# Altium project PCB_Project_Wearable_Master.PrjPcb
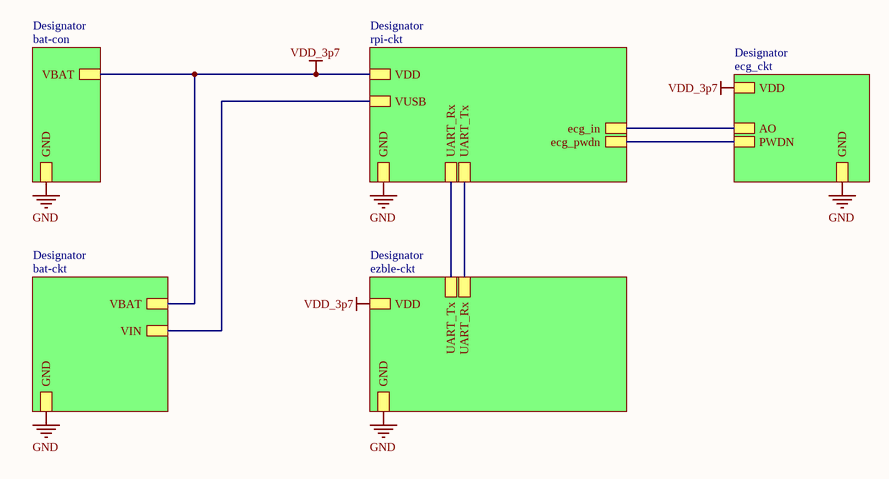
[diagram p0: main.SchDoc]
5 sheets, 46 parts. Net scope: hierarchical (ports join the sheet entries above them; power ports are global).
Sheets:
  main.SchDoc
    Designator = bat-ckt.SchDoc
    Designator = rpi-ckt.SchDoc
    Designator = ezble-ckt.SchDoc
    Designator = ecg_ckt.SchDoc

## Sheet main.SchDoc
size A4; SheetNumber: 1; SheetTotal: 4

### Sub-sheets
Designator = bat-ckt: VBAT, GND, VIN
Designator = bat-con (file not in this document): VBAT, GND
Designator = rpi-ckt: VUSB, VDD, GND, UART_Tx, UART_Rx, ecg_in, ecg_pwdn
Designator = ezble-ckt: UART_Tx, UART_Rx, VDD, GND
Designator = ecg_ckt: VDD, AO, PWDN, GND

### Nets
GND: sheet Designator/GND, sheet Designator/VIN, sheet Designator/GND, sheet Designator/VUSB, sheet Designator/GND, sheet Designator/GND, sheet Designator/GND  [project net QSPI_SS]
VDD_3p7: sheet Designator/VBAT, sheet Designator/VBAT, sheet Designator/VDD, sheet Designator/VDD, sheet Designator/VDD  [project net IOVDD1]
NetRP?_37: sheet Designator/ecg_in, sheet Designator/AO
(unnamed): sheet Designator/UART_Tx, sheet Designator/UART_Rx
(unnamed): sheet Designator/UART_Rx, sheet Designator/UART_Tx
(unnamed): sheet Designator/ecg_pwdn, sheet Designator/PWDN

## Sheet bat-ckt.SchDoc
size A4; SheetNumber: 3; SheetTotal: 5
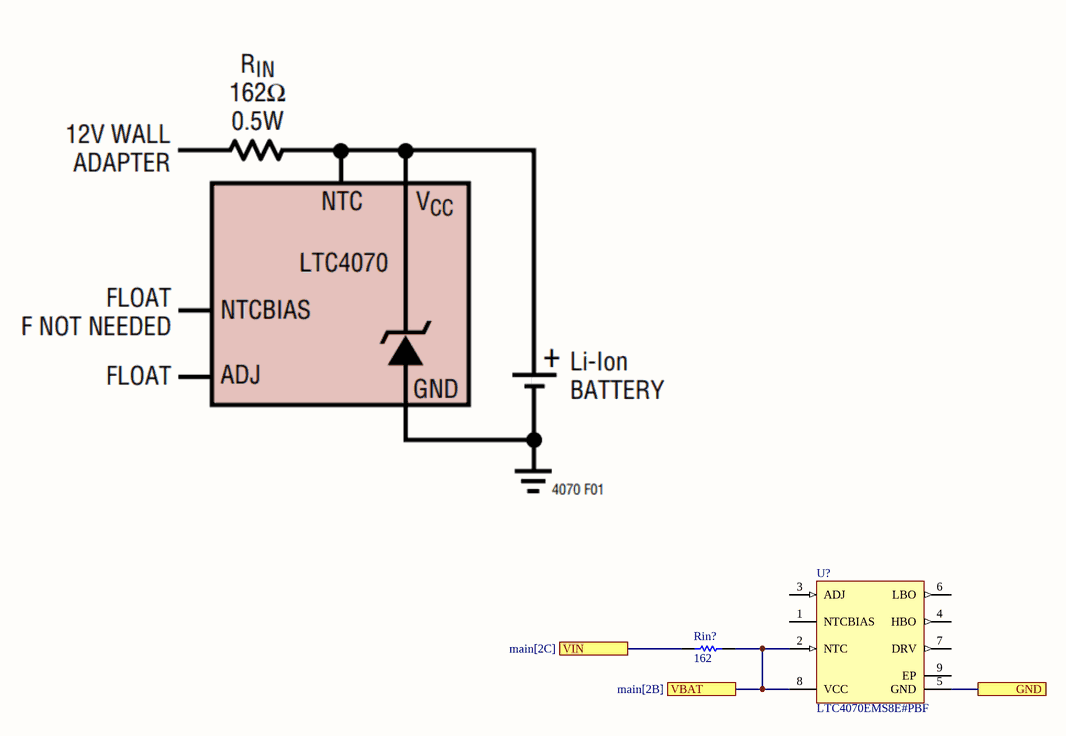
[diagram p1: bat-ckt.SchDoc]

### Parts
(Parts that share a designator on the sheet are numbered #1, #2 ... from top to bottom, then left to right.)
Rin?  value 162  (hidden comment: Resistor)
U?#1  LTC4070EMS8E#PBF  [LT-MS8E-8-2060X1830TP_M]

### Ports
GND, VBAT (see main[2B]), VIN (see main[2C])

### Nets
IOVDD1: Rin?.2 U?#1.2(NTC) U?#1.8(VCC) ; port VBAT
QSPI_SS: Rin?.1 U?#1.5(GND) ; port GND, port VIN

Not connected (* = marked no-connect by the designer): U?#1 1(NTCBIAS) 3(ADJ) 4(HBO) 6(LBO) 7(DRV) 9(EP)

### Library data of the parts
Rin? = Resistor: TC1: 0; SimulationGenericComponent: True; TC2: 0
U?#1 = CMP-0473-00111-1: Li-Ion / Polymer Shunt Battery Charger System, 8-pin SOP (MS8E-8), -40 to 125 degC, Pb-Free; Manufacturer: Linear Technology; Number of Outputs: 1; Topology: Shunt Battery Charger; ComponentLink3URL: http://cds.linear.com/docs/en/datasheet/4070fc.pdf; PackageReference: MS8E-8; ComponentLink1Description: Manufacturer URL; ComponentLink2URL: http://cds.linear.com/docs/en/datasheet/4070fc.pdf; PackageVersion: Rev. E; ComponentLink3Description: Package Specification; ComponentLink1URL: http://www.linear.com/; PackageDescription: 8-Pin Plastic MSOP, Exposed Die Pad, Body 3 x 3 mm, Pitch 0.65 mm; RoHS: TRUE; Mounting Technology: Surface Mount; DatasheetVersion: Rev. E; PartNumber: LTC4070EMS8E#PBF; ComponentLink2Description: Datasheet

## Sheet rpi-ckt.SchDoc
size A4; SheetNumber: 5; SheetTotal: 5
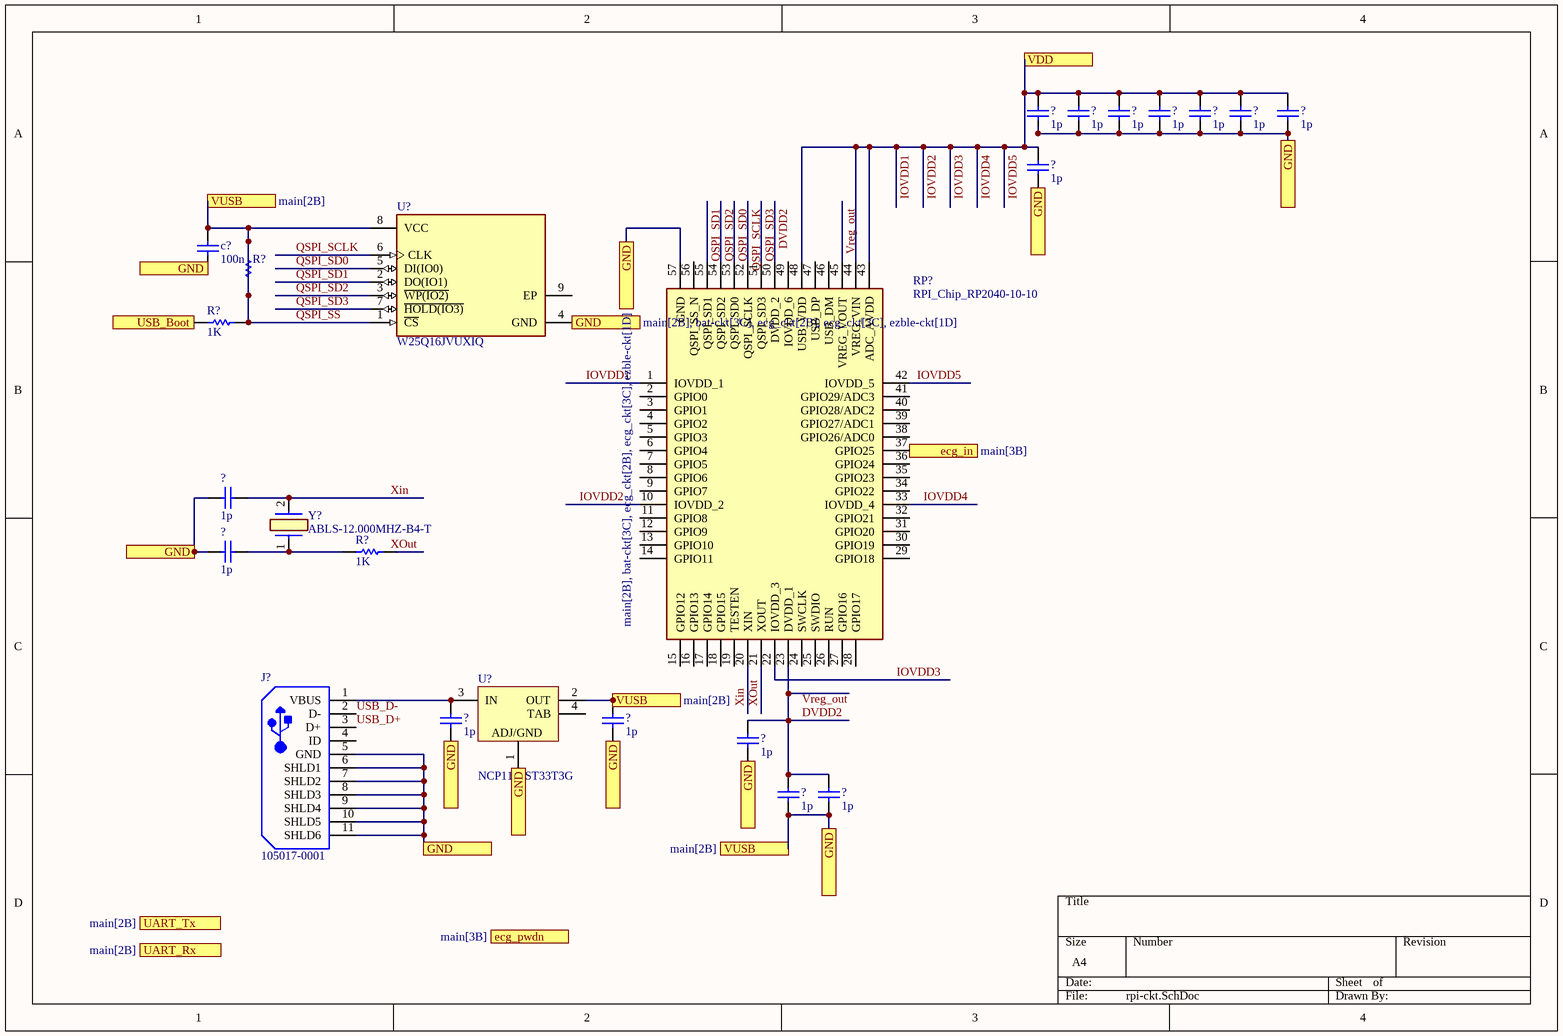
[diagram p2: rpi-ckt.SchDoc]

### Parts
(Parts that share a designator on the sheet are numbered #1, #2 ... from top to bottom, then left to right.)
?#1  value 1p  (hidden comment: Capacitor)
?#2  value 1p  (hidden comment: Capacitor)
?#3  value 1p  (hidden comment: Capacitor)
?#4  value 1p  (hidden comment: Capacitor)
?#5  value 1p  (hidden comment: Capacitor)
?#6  value 1p  (hidden comment: Capacitor)
?#7  value 1p  (hidden comment: Capacitor)
?#8  value 1p  (hidden comment: Capacitor)
?#9  value 1p  (hidden comment: Capacitor)
?#10  value 1p  (hidden comment: Capacitor)
?#11  value 1p  (hidden comment: Capacitor)
?#12  value 1p  (hidden comment: Capacitor)
?#13  value 1p  (hidden comment: Capacitor)
?#14  value 1p  (hidden comment: Capacitor)
?#15  value 1p  (hidden comment: Capacitor)
c?#1  value 100n  (hidden comment: Capacitor)
J?#1  105017-0001  [USB-MICRO-B_V]
R?#1  Resistor  (value not drawn)
R?#2  value 1K  (hidden comment: Resistor)
R?#3  value 1K  (hidden comment: Resistor)
RP?  RPI_Chip_RP2040-10-10  [QFN40P700X700X90-57N-D]
U?#2  W25Q16JVUXIQ  [FP-UX-MFG]
U?#3  NCP1117ST33T3G  [ONSC-SOT-223-4-318H-01_A_V]
Y?  ABLS-12.000MHZ-B4-T  [ABLS]

### Ports
ecg_in (see main[3B]), ecg_pwdn (see main[3B]), GND, GND (see main[2B], bat-ckt[3C], ecg_ckt[2B], ecg_ckt[3C], ezble-ckt[1D]), UART_Rx (see main[2B]), UART_Tx (see main[2B]), USB_Boot, VDD, VUSB (see main[2B])

### Nets
IOVDD1: ?#1.2 ?#2.2 ?#3.2 ?#4.2 ?#5.2 ?#6.2 ?#7.2 ?#8.2 RP?.1(IOVDD_1) RP?.10(IOVDD_2) RP?.22(IOVDD_3) RP?.33(IOVDD_4) RP?.42(IOVDD_5) RP?.43(ADC_AVDD) RP?.44(VREG_VIN) RP?.48(USB_VDD) ; port VDD  [also labelled IOVDD2, IOVDD3, IOVDD4, IOVDD5]
QSPI_SS: ?#1.1 ?#2.1 ?#3.1 ?#4.1 ?#5.1 ?#6.1 ?#7.1 ?#8.1 ?#9.1 ?#10.1 ?#11.1 ?#12.1 ?#12.2 ?#13.1 ?#14.2 ?#15.1 c?#1.1 c?#1.2 J?#1.5(GND) J?#1.6(SHLD1) J?#1.7(SHLD2) J?#1.8(SHLD3) J?#1.9(SHLD4) J?#1.10(SHLD5) J?#1.11(SHLD6) R?#1.1 R?#1.2 R?#2.2 RP?.57(GND) U?#2.1(~{CS}) U?#2.4(GND) U?#2.8(VCC) U?#3.1(ADJ/GND) U?#3.2(OUT) ; port VUSB, port GND
DVDD2: ?#13.2 ?#14.1 ?#15.2 RP?.23(DVDD_1) RP?.50(DVDD_2)
QSPI_SCLK: RP?.52(QSPI_SCLK) U?#2.6(CLK)
QSPI_SD0: RP?.53(QSPI_SD0) U?#2.5(DI(IO0))
QSPI_SD1: RP?.55(QSPI_SD1) U?#2.2(DO(IO1))
QSPI_SD2: RP?.54(QSPI_SD2) U?#2.3(~{WP(IO2)})
QSPI_SD3: RP?.51(QSPI_SD3) U?#2.7(~{HOLD(IO3)})
USB_D+: J?#1.3(D+)
USB_D-: J?#1.2(D-)
Vreg_out: RP?.45(VREG_VOUT)
Xin: ?#9.2 RP?.20(XIN) Y?.2
XOut: RP?.21(XOUT)
Net?#10_2: ?#10.2 R?#3.1 Y?.1
Net?#11_2: ?#11.2 J?#1.1(VBUS) U?#3.3(IN)
NetR?#2_1: R?#2.1 ; port USB_Boot
NetRP?_37: RP?.37(GPIO25) ; port ecg_in

Not connected (* = marked no-connect by the designer): J?#1 4(ID); R?#3 2; RP? 2(GPIO0) 3(GPIO1) 4(GPIO2) 5(GPIO3) 6(GPIO4) 7(GPIO5) 8(GPIO6) 9(GPIO7) 11(GPIO8) 12(GPIO9) 13(GPIO10) 14(GPIO11) 15(GPIO12) 16(GPIO13) 17(GPIO14) 18(GPIO15) 19(TESTEN) 24(SWCLK) 25(SWDIO) 26(RUN) 27(GPIO16) 28(GPIO17) 29(GPIO18) 30(GPIO19) 31(GPIO20) 32(GPIO21) 34(GPIO22) 35(GPIO23) 36(GPIO24) 38(GPIO26/ADC0) 39(GPIO27/ADC1) 40(GPIO28/ADC2) 41(GPIO29/ADC3) 46(USB_DM) 47(USB_DP) 49(IOVDD_6) 56(QSPI_SS_N); U?#2 9(EP); U?#3 4(TAB)

### Notes on the sheet
- Labels drawn without touching a wire or pin: Vreg_out, XOut

### Library data of the parts
?#1-?#15 c?#1 = Capacitor: SimulationGenericComponent: True
J?#1 = CMP-2000-05827-1: Micro-USB B Receptacle, Right Angle, Bottom Mount, Surface Mount, with Solder Tabs, -30 to 85 degC, 5-Pin USB, RoHS, Tape and Reel; Manufacturer: Molex; Featured Product: Micro-USBConnectorsUSBConnectors; Other Names: WM1399DKR; Package Version: Rev. F, 12/2012; Number of Contacts: 5; Connector Type: USB-microB; Catalog Drawings: 1050170001; 3D Model: 105017-0001.stp; Mating Products: WM17145-ND-CABLEMICROUSBBTOSTDA1.0MWM17147-ND-CABLEMICROUSBBTOSTDA2.0MWM17146-ND-CABLEMICROUSBBTOSTDA1.5M; PCN Assembly/Origin: ResinSupplier21/Oct/2015; Voltage - Max: 30V; Online Catalog: Molex-MicroUSB; Manufacturer URL: http://www.molex.com/; Package Description: 5-Leads USB, Micro B, Body 7.5 x 5 mm, Pitch 0.65 mm; Datasheet URL: http://www.molex.com/elqNow/elqRedir.htm?ref=http://www.molex.com/webdocs/datasheets/pdf/en-us/1050170001_IO_CONNECTORS.pdf; Ingress Protection: -; Datasheet Version: 03/2016; Mounting Type: BoardCutout,SurfaceMount,RightAngle; Circuits: 5; Standard Package: 1; Package Reference: MICRO-B; Package URL: http://www.molex.com/pdm_docs/sd/1050170001_sd.pdf; Category: Connectors,Interconnects; Series: -; RoHS Information: 1050170001CertofCompliance; Features: Shielded,SolderRetention; Family: USB,DVI,HDMIConnectors; Specifications: -; Gender: Receptacle; Packaging: Digi-Reel®; Mounting Technology: SurfaceMount
R?#1-R?#3 = Resistor: TC1: 0; SimulationGenericComponent: True; TC2: 0
RP? = RPI_Chip_RP2040-10-10: Integrated Circuit; Manufacturer_Name: RASPBERRY-PI; Manufacturer_Part_Number: RPI Chip RP2040-10-10; Datasheet Link: https://datasheets.raspberrypi.com/rp2040/rp2040-datasheet.pdf; Height: 0.9mm; Mouser Part Number: 358-RP2040CHIP-10-10; Mouser Price/Stock: https://www.mouser.co.uk/ProductDetail/Raspberry-Pi/RPI-Chip-RP2040-10-10?qs=QNEnbhJQKva2vG4DZ5VuhA%3D%3D
U?#2 = CMP-78876-000011-1: IC FLASH 16MBIT SPI/QUAD 8USON; RoHS Compliant: Yes
U?#3 = CMP-1679-00010-1: Low-Dropout Positive Fixed Voltage Regulator, 1 A, 3.3 V Output Voltage, 0 to 125 degC, 4-Pin SOT-223 (318H-01), Pb-Free, Tape and Reel; Resistance: 220 kohm; Type (Resistor): Thick Film; Voltage Rating: 75 V; Tolerance: 1%; Case\Package: 0603; Power Rating: 100 mW; Width: 0.85 mm; Weight: 7.1E-05 oz; ComponentLink2URL: http://www.onsemi.com/pub_link/Collateral/NCP1117-D.PDF; RoHSCompliant: true; Height: 0.45 mm; PackageDescription: 4-Pin Small Outline Transistor, Body 6.5 x 3.5 mm, Pitch 2.3 mm; ComponentLink1Description: Manufacturer URL; ComponentLink1URL: http://www.onsemi.com/; PackageReference: SOT-223-4-318H-01_A; Max Operating Temperature: 155 degC; Packaging: Tape and Reel; REACH SVHC: Unknown; Length: 1.55 mm; Package Quantity: 5000; Radiation Hardening: No; Min Operating Temperature: -55 degC; DatasheetVersion: Rev. 27, 09/2014; Mount: Surface Mount; Case Code (Imperial): 0603; Case Code (Metric): 1608; ComponentLink2Description: Datasheet
Y? = ABLS-12.000MHZ-B4-T: Crystal or Oscillator; Manufacturer_Name: ABRACON; Datasheet Link: https://abracon.com/Resonators/abls.pdf; Manufacturer_Part_Number: ABLS-12.000MHZ-B4-T; Mouser Part Number: 815-ABLS-12.0M-T; Mouser Price/Stock: https://www.mouser.co.uk/ProductDetail/ABRACON/ABLS-12.000MHZ-B4-T?qs=yTU0IcKoRlGSQ8ooxPPVnQ%3D%3D; Arrow Part Number: ABLS-12.000MHZ-B4-T; Arrow Price/Stock: https://www.arrow.com/en/products/abls-12.000mhz-b4-t/abracon?region=nac

## Sheet ezble-ckt.SchDoc
size A4; SheetNumber: 4; SheetTotal: 5
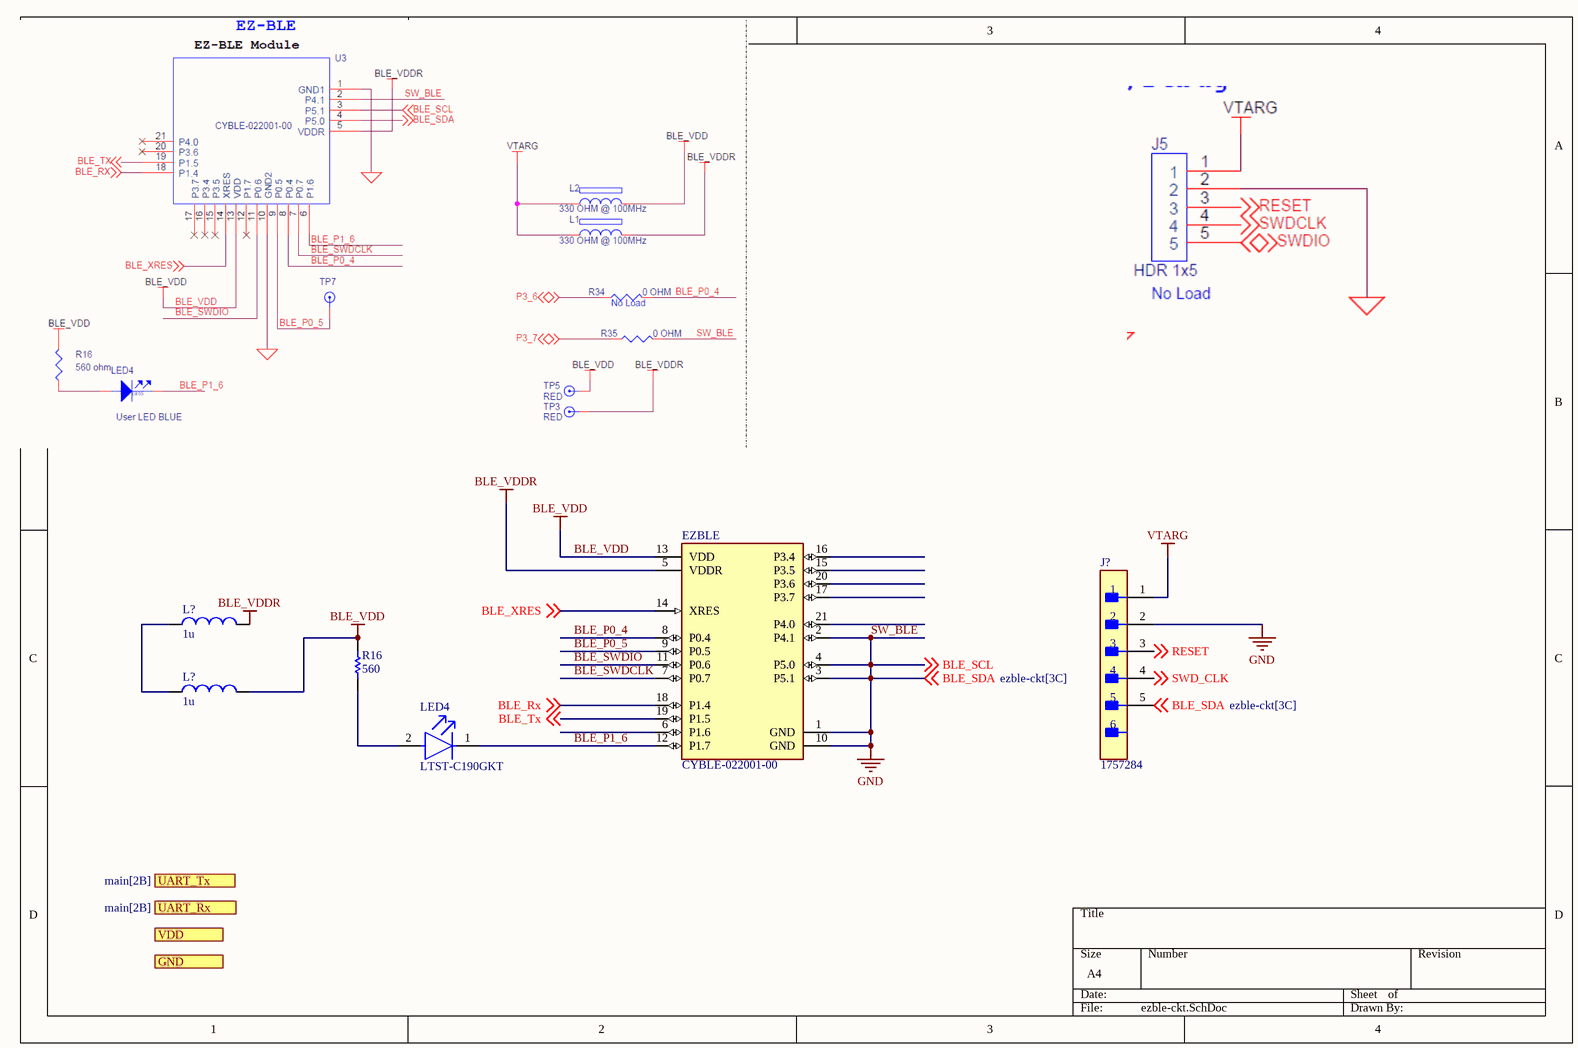
[diagram p3: ezble-ckt.SchDoc]

### Parts
(Parts that share a designator on the sheet are numbered #1, #2 ... from top to bottom, then left to right.)
EZBLE  CYBLE-022001-00  [FP-CYBLE-022001-00-MFG]
J?#2  1757284  [FP-1757284-MFG]
L?#1  value 1u  (hidden comment: Inductor)
L?#2  value 1u  (hidden comment: Inductor)
LED4  LTST-C190GKT  [FP-LTST-C190GKT-MFG]
R16  R16: 560  (hidden comment: Resistor)

### Ports
GND, UART_Rx (see main[2B]), UART_Tx (see main[2B]), VDD

### Nets
BLE_SCL: EZBLE.1(GND) EZBLE.2(P4.1) EZBLE.3(P5.1) EZBLE.4(P5.0) EZBLE.10(GND) J?#2.2 J?#2.5 ; off-sheet BLE_SDA, off-sheet BLE_SCL, port GND  [also labelled BLE_SDA, GND, SW_BLE]  [project net QSPI_SS]
BLE_VDD: EZBLE.13(VDD) L?#2.2 R16.2
BLE_VDDR: EZBLE.5(VDDR) L?#1.2
VTARG: J?#2.1
BLE_P0_4: EZBLE.8(P0.4)
BLE_P0_5: EZBLE.9(P0.5)
BLE_P1_6: EZBLE.12(P1.7) LED4.1(C)
BLE_Rx: EZBLE.18(P1.4) ; off-sheet BLE_Rx
BLE_SWDCLK: EZBLE.7(P0.7)
BLE_SWDIO: EZBLE.11(P0.6)
BLE_Tx: EZBLE.19(P1.5) ; off-sheet BLE_Tx
BLE_XRES: EZBLE.14(XRES) ; off-sheet BLE_XRES
RESET: J?#2.3 ; off-sheet RESET
SWD_CLK: J?#2.4 ; off-sheet SWD_CLK
NetL?#1_1: L?#1.1 L?#2.1
NetLED4_2: LED4.2(A) R16.1

Not connected (* = marked no-connect by the designer): EZBLE 6(P1.6) 15(P3.5) 16(P3.4) 17(P3.7) 20(P3.6) 21(P4.0)

### Library data of the parts
EZBLE = CMP-2000-05093-2: RX TXRX MOD BLUETOOTH CHIP SMD; Current - Transmitting: 15.6mA; Current - Receiving: 16.4mA; Interface: I2C; Frequency: 2.4GHz; Sensitivity: -91dBm; Max Supply Voltage: 5.5V; Memory Size: 16KB; Min Supply Voltage: 1.8V; Data Rate: 1Mbps; Min Operating Temperature: -40°C; Mount: Surface Mount; Max Operating Temperature: 85°C; Packaging: Tape and Reel; REACH SVHC: No SVHC; Case/Package: Module; Lead Free: Lead Free; Number of Pins: 21
J?#2 = CMP-09399-000007-1: TERM BLOCK HDR 6POS 90DEG 5.08MM; Gender: Male; Voltage Rating: 250V; Max Current Rating: 12A; Number of Positions: 6; Current: 15A; Approvals: UL; Number of Levels: 1; Voltage: 300V; Voltage Rating (DC): 320V; Connector Type: Plug; Termination: Solder; Weight: 5.396916oz; Flammability Rating: UL94 V-0; Packaging: Bulk; Package Quantity: 50; Contact Plating: Tin; REACH SVHC: No SVHC; Color: Grey; Current Rating: 12A; Mount: Through Hole; Height: 12.1mm; Number of Rows: 1; Number of Contacts: 6; Housing Material: Polybutylene; Series: MSTBA; Pitch: 5.08mm; RoHS Compliant: Yes; Orientation: Right Angle; Housing Color: Green; Length: 32.48mm; Number of Positions Per Level: 6; Width: 32.4mm; Depth: 12mm; Lead Free: Lead Free; Contact Material: Tin; Number of Poles: 6
L?#1 L?#2 = Inductor: SimulationGenericComponent: True
LED4 = CMP-22017-000005-2: LED GREEN CLEAR CHIP SMD; Dominant Wavelength: 569nm; Reverse Voltage: 5V; Lens Color: Colorless; Viewing Angle: 130°; Voltage: 2V; Forward Current: 30mA; Power Dissipation: 100mW; Luminous Intensity: 6mcd; Number of LEDs: 1; Forward Voltage: 2.1V; Wavelength: 565nm; Test Current: 10mA; Min Operating Temperature: -55°C; Lens Style: Clear; Mount: Surface Mount; Width: 0.8mm; Packaging: Tape and Reel; Lens Transparency: Clear; Case Code (Metric): 1608; Depth: 0.8mm; Case Code (Imperial): 0603; Case/Package: 0603; Number of Pins: 2; Max Operating Temperature: 85°C; Lead Free: Lead Free; Number of Elements: 1; Length: 1.6mm; Height: 0.8mm; Package Quantity: 1; Power Rating: 100mW; Radiation Hardening: No; Illumination Color: Green; Color: Green
R16 = Resistor: TC1: 0; SimulationGenericComponent: True; TC2: 0

## Sheet ecg_ckt.SchDoc
size A4; SheetNumber: 2; SheetTotal: 5
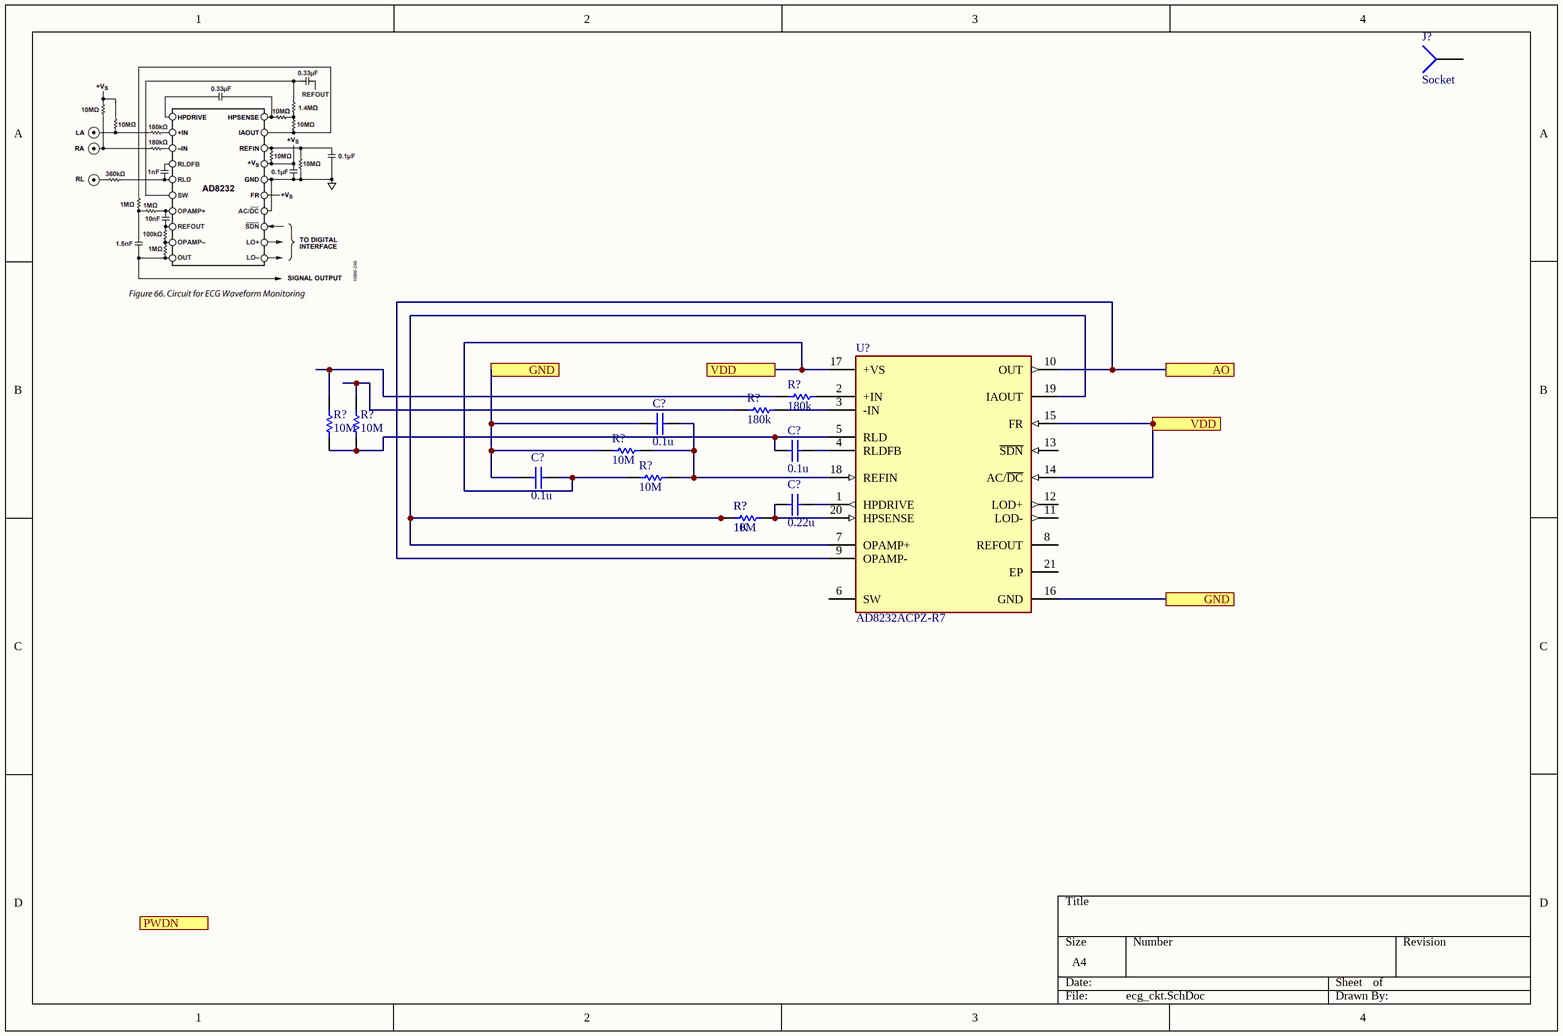
[diagram p4: ecg_ckt.SchDoc]

### Parts
(Parts that share a designator on the sheet are numbered #1, #2 ... from top to bottom, then left to right.)
C?#2  value 0.1u  (hidden comment: Capacitor)
C?#3  value 0.1u  (hidden comment: Capacitor)
C?#4  value 0.1u  (hidden comment: Capacitor)
C?#5  value 0.22u  (hidden comment: Capacitor)
J?#3  Socket  [PIN1]
R?#4  value 10M  (hidden comment: Resistor)
R?#5  value 10M  (hidden comment: Resistor)
R?#6  value 180k  (hidden comment: Resistor)
R?#7  value 180k  (hidden comment: Resistor)
R?#8  value 10M  (hidden comment: Resistor)
R?#9  value 10M  (hidden comment: Resistor)
R?#10  value 1K  (hidden comment: Resistor)
R?#11  value 10M  (hidden comment: Resistor)
U?#4  AD8232ACPZ-R7  [FP-CP-20-8-IPC_C]

### Ports
AO, GND, PWDN, VDD

### Nets
IOVDD1: C?#4.2 R?#9.1 U?#4.14(AC/~{DC}) U?#4.15(FR) U?#4.17(+VS) ; port VDD
QSPI_SS: C?#2.1 C?#4.1 R?#8.1 U?#4.16(GND) ; port GND
NetC?#2_2: C?#2.2 R?#8.2 R?#9.2 U?#4.18(REFIN)
NetC?#3_1: C?#3.1 U?#4.4(RLDFB)
NetC?#3_2: C?#3.2 R?#4.2 R?#5.2 U?#4.5(RLD)
NetC?#5_1: C?#5.1 U?#4.1(HPDRIVE)
NetC?#5_2: C?#5.2 R?#10.2 R?#11.2 U?#4.20(HPSENSE)
NetR?#4_1: R?#4.1 R?#6.1
NetR?#5_1: R?#5.1 R?#7.1
NetR?#6_2: R?#6.2 U?#4.2(+IN)
NetR?#7_2: R?#7.2 U?#4.3(-IN)
NetR?#10_1: R?#10.1 R?#11.1 U?#4.7(OPAMP+) U?#4.19(IAOUT)
NetRP?_37: U?#4.9(OPAMP-) U?#4.10(OUT) ; port AO

Not connected (* = marked no-connect by the designer): J?#3 1; U?#4 6(SW) 8(REFOUT) 11(LOD-) 12(LOD+) 13(~{SDN}) 21(EP)

### Library data of the parts
C?#2-C?#5 = Capacitor: SimulationGenericComponent: True
R?#4-R?#11 = Resistor: TC1: 0; SimulationGenericComponent: True; TC2: 0
U?#4 = CMP-09085-000003-1: IC ECG FRONT END 20LFCSP; Input Offset Voltage (Vos): 3mV; Power Supply Rejection Ratio (PSRR): 90dB; Input Bias Current: 50pA; Nominal Supply Current: 170uA; Min Supply Voltage: 2V; Common Mode Rejection Ratio: 80dB; Max Supply Voltage: 3.5V; Contact Plating: Tin; Operating Supply Current: 170uA; Packaging: Tape and Reel; REACH SVHC: No SVHC; Case/Package: LFCSP EP; Number of Pins: 20; Lead Free: Contains Lead; Min Operating Temperature: -40°C; Package Quantity: 1500; Mount: Surface Mount; Max Operating Temperature: 85°C
J?#3 = Socket: LatestRevisionDate: 17-Jul-2002; LatestRevisionNote: Re-released for DXP Platform.; Publisher: Altium Limited

## Nets that join several sheets
IOVDD1: bat-ckt (Rin?.2 U?#1.2 U?#1.8), rpi-ckt (16 pins), ecg_ckt (5 pins)
QSPI_SS: bat-ckt (Rin?.1 U?#1.5), rpi-ckt (34 pins), ezble-ckt (7 pins), ecg_ckt (C?#2.1 C?#4.1 R?#8.1 U?#4.16)
NetRP?_37: rpi-ckt (RP?.37), ecg_ckt (U?#4.9 U?#4.10)